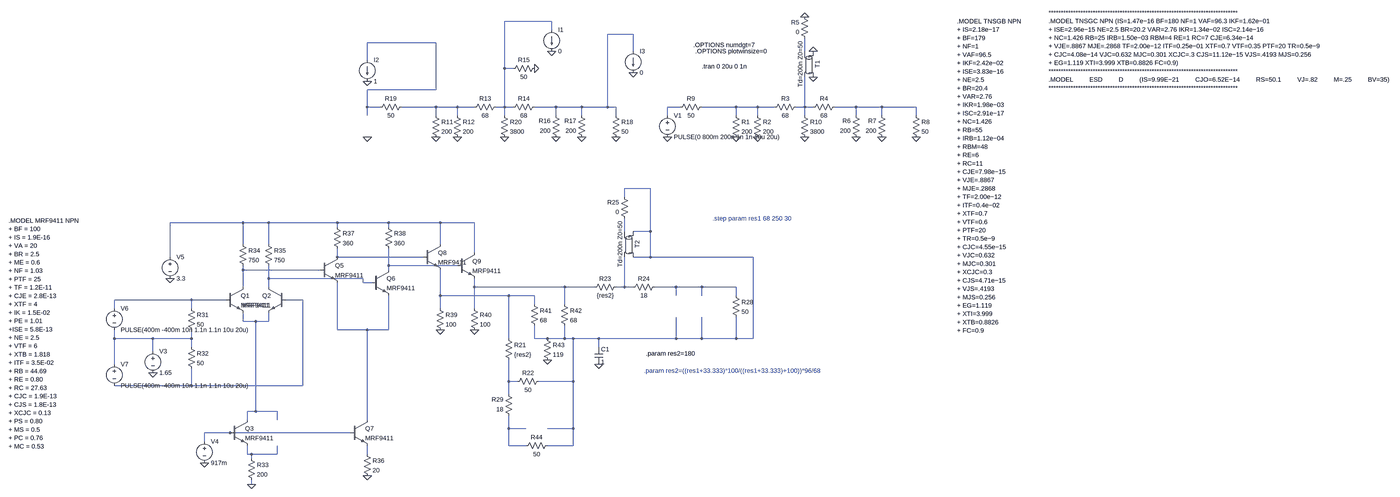
[diagram p0: schematic Draft10.asc, whole sheet]
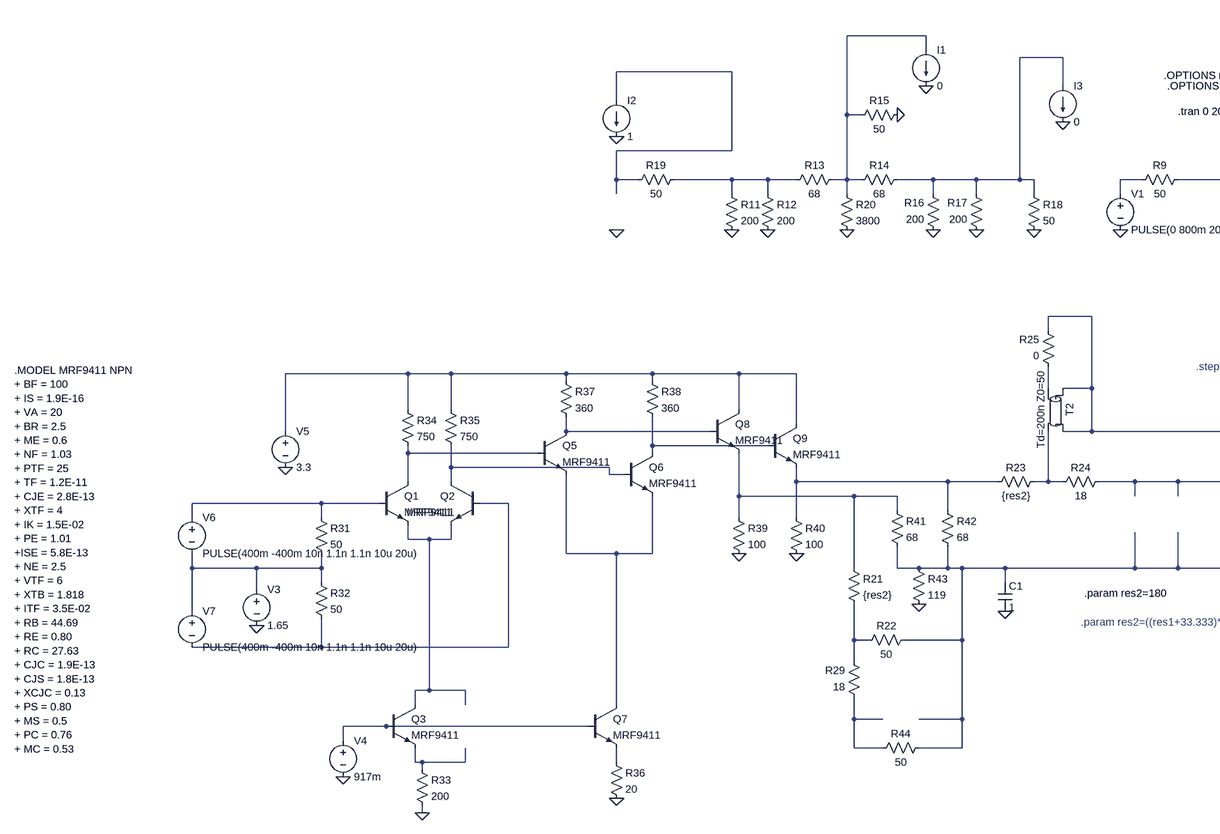
[diagram p1: schematic Draft10.asc, part, row 1 of 1, column 1 of 2]
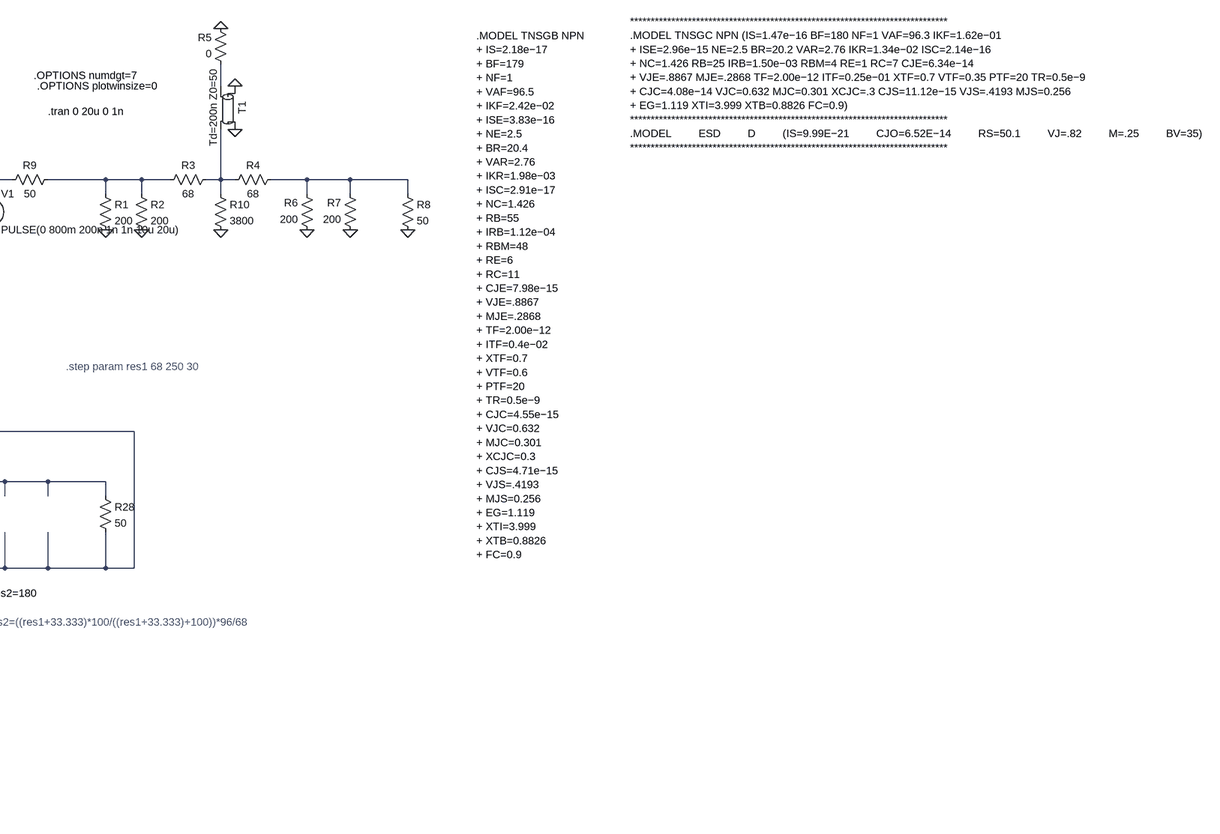
[diagram p2: schematic Draft10.asc, part, row 1 of 1, column 2 of 2]
Draft10.asc, the LTspice schematic file:
Version 4
SHEET 1 2704 1580
WIRE -608 -240 -784 -240
WIRE -608 -208 -608 -240
WIRE -304 -192 -400 -192
WIRE -1040 -160 -1296 -160
WIRE -304 -128 -304 -192
WIRE 336 -128 336 -176
WIRE -1296 -96 -1296 -160
WIRE -784 -64 -784 -240
WIRE -752 -64 -784 -64
WIRE -1040 16 -1040 -160
WIRE -1040 16 -1296 16
WIRE -1296 80 -1296 16
WIRE -1248 80 -1296 80
WIRE -1040 80 -1168 80
WIRE -960 80 -1040 80
WIRE -896 80 -960 80
WIRE -784 80 -784 -64
WIRE -784 80 -816 80
WIRE -752 80 -784 80
WIRE -592 80 -672 80
WIRE -496 80 -592 80
WIRE -400 80 -400 -192
WIRE -400 80 -496 80
WIRE -368 80 -400 80
WIRE -128 80 -176 80
WIRE 80 80 -48 80
WIRE 160 80 80 80
WIRE 224 80 160 80
WIRE 336 80 336 -32
WIRE 336 80 304 80
WIRE 368 80 336 80
WIRE 528 80 448 80
WIRE 624 80 528 80
WIRE 752 80 624 80
WIRE -1296 112 -1296 80
WIRE -1040 112 -1040 80
WIRE -960 112 -960 80
WIRE -784 112 -784 80
WIRE -592 112 -592 80
WIRE -496 112 -496 80
WIRE -368 112 -368 80
WIRE -176 112 -176 80
WIRE 80 112 80 80
WIRE 160 112 160 80
WIRE 336 112 336 80
WIRE 528 112 528 80
WIRE 624 112 624 80
WIRE 752 112 752 80
WIRE -240 384 -336 384
WIRE -336 416 -336 384
WIRE -1760 512 -2032 512
WIRE -1664 512 -1760 512
WIRE -1408 512 -1664 512
WIRE -1216 512 -1408 512
WIRE -1024 512 -1216 512
WIRE -896 512 -1024 512
WIRE -1408 528 -1408 512
WIRE -1216 528 -1216 512
WIRE -336 544 -336 496
WIRE -240 544 -240 384
WIRE -240 544 -304 544
WIRE -1760 592 -1760 512
WIRE -1664 592 -1664 512
WIRE -1024 592 -1024 512
WIRE -896 624 -896 512
WIRE -2032 640 -2032 512
WIRE -1408 640 -1408 608
WIRE -1088 640 -1408 640
WIRE -240 640 -240 544
WIRE -240 640 -304 640
WIRE 144 640 -240 640
WIRE -1216 672 -1216 608
WIRE -960 672 -1216 672
WIRE -1760 688 -1760 672
WIRE -1472 688 -1760 688
WIRE -1216 688 -1216 672
WIRE -1664 720 -1664 672
WIRE -1312 720 -1664 720
WIRE -1312 736 -1312 720
WIRE -1280 736 -1312 736
WIRE -1760 752 -1760 688
WIRE -1664 752 -1664 720
WIRE -896 752 -896 720
WIRE -560 752 -896 752
WIRE -448 752 -560 752
WIRE -336 752 -336 640
WIRE -336 752 -368 752
WIRE -304 752 -336 752
WIRE -144 752 -224 752
WIRE -48 752 -144 752
WIRE 80 752 -48 752
WIRE -1024 784 -1024 688
WIRE -768 784 -1024 784
WIRE -672 784 -768 784
WIRE -144 784 -144 752
WIRE -48 784 -48 752
WIRE 80 784 80 752
WIRE -1952 800 -2240 800
WIRE -1824 800 -1952 800
WIRE -1536 800 -1600 800
WIRE -672 816 -672 784
WIRE -560 816 -560 752
WIRE -2240 832 -2240 800
WIRE -1952 832 -1952 800
WIRE -1024 832 -1024 784
WIRE -896 832 -896 752
WIRE -1760 880 -1760 848
WIRE -1712 880 -1760 880
WIRE -1664 880 -1664 848
WIRE -1664 880 -1712 880
WIRE -1408 912 -1408 736
WIRE -1296 912 -1408 912
WIRE -1216 912 -1216 784
WIRE -1216 912 -1296 912
WIRE -2240 944 -2240 912
WIRE -2096 944 -2240 944
WIRE -1952 944 -1952 912
WIRE -1952 944 -2096 944
WIRE -768 944 -768 784
WIRE -672 944 -672 896
WIRE -624 944 -672 944
WIRE -560 944 -560 896
WIRE -560 944 -624 944
WIRE -528 944 -560 944
WIRE -432 944 -528 944
WIRE -144 944 -144 864
WIRE -144 944 -432 944
WIRE -48 944 -48 864
WIRE -48 944 -144 944
WIRE 80 944 80 864
WIRE 80 944 -48 944
WIRE 144 944 144 640
WIRE 144 944 80 944
WIRE -1952 976 -1952 944
WIRE -432 976 -432 944
WIRE -2096 992 -2096 944
WIRE -2240 1040 -2240 944
WIRE -768 1104 -768 1024
WIRE -736 1104 -768 1104
WIRE -528 1104 -528 944
WIRE -528 1104 -656 1104
WIRE -1952 1120 -1952 1056
WIRE -1952 1120 -2240 1120
WIRE -1536 1120 -1536 800
WIRE -1536 1120 -1952 1120
WIRE -768 1152 -768 1104
WIRE -1712 1216 -1712 880
WIRE -1712 1216 -1744 1216
WIRE -1632 1216 -1712 1216
WIRE -1744 1248 -1744 1216
WIRE -1632 1248 -1632 1216
WIRE -1296 1248 -1296 912
WIRE -768 1280 -768 1232
WIRE -704 1280 -768 1280
WIRE -528 1280 -528 1104
WIRE -528 1280 -624 1280
WIRE -1808 1296 -1904 1296
WIRE -1360 1296 -1808 1296
WIRE -1904 1328 -1904 1296
WIRE -768 1344 -768 1280
WIRE -704 1344 -768 1344
WIRE -528 1344 -528 1280
WIRE -528 1344 -624 1344
WIRE -1744 1376 -1744 1344
WIRE -1728 1376 -1744 1376
WIRE -1632 1376 -1632 1344
WIRE -1632 1376 -1728 1376
WIRE -1296 1376 -1296 1344
WIRE -1728 1392 -1728 1376
WIRE -1728 1488 -1728 1472
FLAG 752 192 0
FLAG 624 192 0
FLAG 528 192 0
FLAG 160 192 0
FLAG 80 192 0
FLAG 336 -256 0
FLAG 368 -32 0
FLAG -176 192 0
FLAG 368 -128 0
FLAG 336 192 0
FLAG -368 192 0
FLAG -496 192 0
FLAG -592 192 0
FLAG -960 192 0
FLAG -1040 192 0
FLAG -1296 192 0
FLAG -784 192 0
FLAG -608 -128 0
FLAG -1296 -16 0
FLAG -304 -48 0
FLAG -672 -64 0
FLAG -2096 1072 0
FLAG -1904 1408 0
FLAG -1728 1488 0
FLAG -2032 720 0
FLAG -1296 1456 0
FLAG -896 912 0
FLAG -1024 912 0
FLAG -624 1024 0
FLAG -432 1040 0
SYMBOL res 64 96 R0
SYMATTR InstName R1
SYMATTR Value 200
SYMBOL res 144 96 R0
SYMATTR InstName R2
SYMATTR Value 200
SYMBOL res 320 64 R90
WINDOW 0 0 56 VBottom 2
WINDOW 3 32 56 VTop 2
SYMATTR InstName R3
SYMATTR Value 68
SYMBOL res 464 64 R90
WINDOW 0 0 56 VBottom 2
WINDOW 3 32 56 VTop 2
SYMATTR InstName R4
SYMATTR Value 68
SYMBOL res 352 -160 R180
WINDOW 0 36 76 Left 2
WINDOW 3 36 40 Left 2
SYMATTR InstName R5
SYMATTR Value 0
SYMBOL res 544 208 R180
WINDOW 0 36 76 Left 2
WINDOW 3 36 40 Left 2
SYMATTR InstName R6
SYMATTR Value 200
SYMBOL res 640 208 R180
WINDOW 0 36 76 Left 2
WINDOW 3 36 40 Left 2
SYMATTR InstName R7
SYMATTR Value 200
SYMBOL res 736 96 R0
SYMATTR InstName R8
SYMATTR Value 50
SYMBOL res -32 64 R90
WINDOW 0 0 56 VBottom 2
WINDOW 3 32 56 VTop 2
SYMATTR InstName R9
SYMATTR Value 50
SYMBOL tline 352 -80 R90
SYMATTR InstName T1
SYMATTR Value Td=200n Z0=50
SYMBOL voltage -176 96 R0
WINDOW 123 0 0 Left 0
WINDOW 39 0 0 Left 0
SYMATTR InstName V1
SYMATTR Value PULSE(0 800m 200n 1n 1n 10u 20u)
SYMBOL res 320 96 R0
SYMATTR InstName R10
SYMATTR Value 3800
SYMBOL res -1056 96 R0
SYMATTR InstName R11
SYMATTR Value 200
SYMBOL res -976 96 R0
SYMATTR InstName R12
SYMATTR Value 200
SYMBOL res -800 64 R90
WINDOW 0 0 56 VBottom 2
WINDOW 3 32 56 VTop 2
SYMATTR InstName R13
SYMATTR Value 68
SYMBOL res -656 64 R90
WINDOW 0 0 56 VBottom 2
WINDOW 3 32 56 VTop 2
SYMATTR InstName R14
SYMATTR Value 68
SYMBOL res -576 208 R180
WINDOW 0 36 76 Left 2
WINDOW 3 36 40 Left 2
SYMATTR InstName R16
SYMATTR Value 200
SYMBOL res -480 208 R180
WINDOW 0 36 76 Left 2
WINDOW 3 36 40 Left 2
SYMATTR InstName R17
SYMATTR Value 200
SYMBOL res -384 96 R0
SYMATTR InstName R18
SYMATTR Value 50
SYMBOL res -1152 64 R90
WINDOW 0 0 56 VBottom 2
WINDOW 3 32 56 VTop 2
SYMATTR InstName R19
SYMATTR Value 50
SYMBOL res -800 96 R0
SYMATTR InstName R20
SYMATTR Value 3800
SYMBOL current -608 -208 R0
WINDOW 123 0 0 Left 0
WINDOW 39 0 0 Left 0
SYMATTR InstName I1
SYMATTR Value 0
SYMBOL current -1296 -96 R0
WINDOW 123 0 0 Left 0
WINDOW 39 0 0 Left 0
SYMATTR InstName I2
SYMATTR Value 1
SYMBOL current -304 -128 R0
WINDOW 123 0 0 Left 0
WINDOW 39 0 0 Left 0
SYMATTR InstName I3
SYMATTR Value 0
SYMBOL res -656 -80 R90
WINDOW 0 0 56 VBottom 2
WINDOW 3 32 56 VTop 2
SYMATTR InstName R15
SYMATTR Value 50
SYMBOL res -352 736 R90
WINDOW 0 0 56 VBottom 2
WINDOW 3 32 56 VTop 2
SYMATTR InstName R23
SYMATTR Value {res2}
SYMBOL res -208 736 R90
WINDOW 0 0 56 VBottom 2
WINDOW 3 32 56 VTop 2
SYMATTR InstName R24
SYMATTR Value 18
SYMBOL res -320 512 R180
WINDOW 0 36 76 Left 2
WINDOW 3 36 40 Left 2
SYMATTR InstName R25
SYMATTR Value 0
SYMBOL res 64 768 R0
SYMATTR InstName R28
SYMATTR Value 50
SYMBOL tline -320 592 R90
SYMATTR InstName T2
SYMATTR Value Td=200n Z0=50
SYMBOL res -1968 816 R0
SYMATTR InstName R31
SYMATTR Value 50
SYMBOL res -1968 960 R0
SYMATTR InstName R32
SYMATTR Value 50
SYMBOL voltage -2096 976 R0
WINDOW 123 0 0 Left 0
WINDOW 39 0 0 Left 0
SYMATTR InstName V3
SYMATTR Value 1.65
SYMBOL npn -1824 752 R0
SYMATTR InstName Q1
SYMATTR Value MRF9411
SYMBOL npn -1600 752 M0
SYMATTR InstName Q2
SYMATTR Value MRF9411
SYMBOL npn -1808 1248 R0
SYMATTR InstName Q3
SYMATTR Value MRF9411
SYMBOL voltage -1904 1312 R0
WINDOW 123 0 0 Left 0
WINDOW 39 0 0 Left 0
SYMATTR InstName V4
SYMATTR Value 917m
SYMBOL res -1744 1376 R0
SYMATTR InstName R33
SYMATTR Value 200
SYMBOL res -1776 576 R0
SYMATTR InstName R34
SYMATTR Value 750
SYMBOL res -1680 576 R0
SYMATTR InstName R35
SYMATTR Value 750
SYMBOL voltage -2032 624 R0
WINDOW 123 0 0 Left 0
WINDOW 39 0 0 Left 0
SYMATTR InstName V5
SYMATTR Value 3.3
SYMBOL voltage -2240 816 R0
WINDOW 123 0 0 Left 0
WINDOW 39 0 0 Left 0
SYMATTR InstName V6
SYMATTR Value PULSE(400m -400m 10n 1.1n 1.1n 10u 20u)
SYMBOL voltage -2240 1024 R0
WINDOW 123 0 0 Left 0
WINDOW 39 0 0 Left 0
SYMATTR InstName V7
SYMATTR Value PULSE(400m -400m 10n 1.1n 1.1n 10u 20u)
SYMBOL npn -1472 640 R0
SYMATTR InstName Q5
SYMATTR Value MRF9411
SYMBOL npn -1280 688 R0
SYMATTR InstName Q6
SYMATTR Value MRF9411
SYMBOL npn -1360 1248 R0
SYMATTR InstName Q7
SYMATTR Value MRF9411
SYMBOL res -1312 1360 R0
SYMATTR InstName R36
SYMATTR Value 20
SYMBOL res -1424 512 R0
SYMATTR InstName R37
SYMATTR Value 360
SYMBOL res -1232 512 R0
SYMATTR InstName R38
SYMATTR Value 360
SYMBOL npn -1088 592 R0
SYMATTR InstName Q8
SYMATTR Value MRF9411
SYMBOL npn -960 624 R0
SYMATTR InstName Q9
SYMATTR Value MRF9411
SYMBOL res -1040 816 R0
SYMATTR InstName R39
SYMATTR Value 100
SYMBOL res -912 816 R0
SYMATTR InstName R40
SYMATTR Value 100
SYMBOL res -688 800 R0
SYMATTR InstName R41
SYMATTR Value 68
SYMBOL res -576 800 R0
SYMATTR InstName R42
SYMATTR Value 68
SYMBOL res -640 928 R0
SYMATTR InstName R43
SYMATTR Value 119
SYMBOL res -784 928 R0
SYMATTR InstName R21
SYMATTR Value {res2}
SYMBOL res -640 1088 R90
WINDOW 0 0 56 VBottom 2
WINDOW 3 32 56 VTop 2
SYMATTR InstName R22
SYMATTR Value 50
SYMBOL res -752 1248 R180
WINDOW 0 36 76 Left 2
WINDOW 3 36 40 Left 2
SYMATTR InstName R29
SYMATTR Value 18
SYMBOL res -608 1328 R90
WINDOW 0 0 56 VBottom 2
WINDOW 3 32 56 VTop 2
SYMATTR InstName R44
SYMATTR Value 50
SYMBOL cap -448 976 R0
SYMATTR InstName C1
SYMATTR Value 1
TEXT -48 -72 Left 2 !.tran 0 20u 0 1n
TEXT 936 -240 Left 2 !.MODEL TNSGB NPN\n+ IS=2.18e−17\n+ BF=179\n+ NF=1 \n+ VAF=96.5 \n+ IKF=2.42e−02\n+ ISE=3.83e−16\n+ NE=2.5\n+ BR=20.4\n+ VAR=2.76\n+ IKR=1.98e−03\n+ ISC=2.91e−17\n+ NC=1.426\n+ RB=55\n+ IRB=1.12e−04\n+ RBM=48\n+ RE=6\n+ RC=11\n+ CJE=7.98e−15\n+ VJE=.8867\n+ MJE=.2868\n+ TF=2.00e−12\n+ ITF=0.4e−02\n+ XTF=0.7\n+ VTF=0.6\n+ PTF=20\n+ TR=0.5e−9\n+ CJC=4.55e−15\n+ VJC=0.632\n+ MJC=0.301\n+ XCJC=0.3\n+ CJS=4.71e−15\n+ VJS=.4193\n+ MJS=0.256\n+ EG=1.119\n+ XTI=3.999\n+ XTB=0.8826\n+ FC=0.9
TEXT 1368 -272 Left 2 !*****************************************************************************\n.MODEL TNSGC NPN (IS=1.47e−16 BF=180 NF=1 VAF=96.3 IKF=1.62e−01\n+ ISE=2.96e−15 NE=2.5 BR=20.2 VAR=2.76 IKR=1.34e−02 ISC=2.14e−16\n+ NC=1.426 RB=25 IRB=1.50e−03 RBM=4 RE=1 RC=7 CJE=6.34e−14\n+ VJE=.8867 MJE=.2868 TF=2.00e−12 ITF=0.25e−01 XTF=0.7 VTF=0.35 PTF=20 TR=0.5e−9\n+ CJC=4.08e−14 VJC=0.632 MJC=0.301 XCJC=.3 CJS=11.12e−15 VJS=.4193 MJS=0.256\n+ EG=1.119 XTI=3.999 XTB=0.8826 FC=0.9)\n*****************************************************************************\n.MODEL         ESD         D         (IS=9.99E−21         CJO=6.52E−14         RS=50.1         VJ=.82         M=.25         BV=35)\n*****************************************************************************
TEXT -2648 504 Left 2 !.MODEL MRF9411 NPN \n+ BF = 100\n+ IS = 1.9E-16\n+ VA = 20\n+ BR = 2.5\n+ ME = 0.6\n+ NF = 1.03\n+ PTF = 25\n+ TF = 1.2E-11\n+ CJE = 2.8E-13\n+ XTF = 4\n+ IK = 1.5E-02\n+ PE = 1.01\n+ISE = 5.8E-13\n+ NE = 2.5\n+ VTF = 6\n+ XTB = 1.818\n+ ITF = 3.5E-02\n+ RB = 44.69\n+ RE = 0.80\n+ RC = 27.63\n+ CJC = 1.9E-13\n+ CJS = 1.8E-13\n+ XCJC = 0.13\n+ PS = 0.80\n+ MS = 0.5\n+ PC = 0.76\n+ MC = 0.53
TEXT -8 496 Left 2 ;.step param res1 68 250 30
TEXT -264 1064 Left 2 ;.param res2=((res1+33.333)*100/((res1+33.333)+100))*96/68
TEXT -256 1000 Left 2 !.param res2=180
TEXT -72 -128 Left 2 !.OPTIONS plotwinsize=0
TEXT -80 -152 Left 2 !.OPTIONS numdgt=7

The netlist it stands for:
* Draft10.asc
R1 N007 0 200
R2 N007 0 200
R3 N008 N007 68
R4 N009 N008 68
R5 N004 0 0
R6 0 N009 200
R7 0 N009 200
R8 N009 0 50
R9 N007 N006 50
T1 0 N004 0 N008 Td=200n Z0=50
V1 N006 0 PULSE(0 800m 200n 1n 1n 10u 20u)
R10 N008 0 3800
R11 N005 0 200
R12 N005 0 200
R13 N001 N005 68
R14 N002 N001 68
R16 0 N002 200
R17 0 N002 200
R18 N002 0 50
R19 N005 N003 50
R20 N001 0 3800
I1 N001 0 0
I2 N003 0 1
I3 N002 0 0
R15 0 N001 50
R23 N018 N017 {res2}
R24 N019 N018 18
R25 N012 N010 0
R28 N019 N010 50
T2 N010 N012 N010 N018 Td=200n Z0=50
R31 N021 N025 50
R32 N025 N022 50
V3 N025 0 1.65
Q1 N015 N021 N023 0 MRF9411
Q2 N016 N022 N023 0 MRF9411
Q3 N023 N028 N029 0 MRF9411
V4 N028 0 917m
R33 N029 0 200
R34 N011 N015 750
R35 N011 N016 750
V5 N011 0 3.3
V6 N021 N025 PULSE(400m -400m 10n 1.1n 1.1n 10u 20u)
V7 N025 N022 PULSE(400m -400m 10n 1.1n 1.1n 10u 20u)
Q5 N013 N015 N024 0 MRF9411
Q6 N014 N016 N024 0 MRF9411
Q7 N024 N028 N030 0 MRF9411
R36 N030 0 20
R37 N011 N013 360
R38 N011 N014 360
Q8 N011 N013 N020 0 MRF9411
Q9 N011 N014 N017 0 MRF9411
R39 N020 0 100
R40 N017 0 100
R41 N020 N010 68
R42 N017 N010 68
R43 N010 0 119
R21 N020 N026 {res2}
R22 N010 N026 50
R29 N027 N026 18
R44 N010 N027 50
C1 N010 0 1
.model NPN NPN
.model PNP PNP
.lib standard.bjt
.tran 0 20u 0 1n
.MODEL TNSGB NPN
+ IS=2.18e−17
+ BF=179
+ NF=1
+ VAF=96.5
+ IKF=2.42e−02
+ ISE=3.83e−16
+ NE=2.5
+ BR=20.4
+ VAR=2.76
+ IKR=1.98e−03
+ ISC=2.91e−17
+ NC=1.426
+ RB=55
+ IRB=1.12e−04
+ RBM=48
+ RE=6
+ RC=11
+ CJE=7.98e−15
+ VJE=.8867
+ MJE=.2868
+ TF=2.00e−12
+ ITF=0.4e−02
+ XTF=0.7
+ VTF=0.6
+ PTF=20
+ TR=0.5e−9
+ CJC=4.55e−15
+ VJC=0.632
+ MJC=0.301
+ XCJC=0.3
+ CJS=4.71e−15
+ VJS=.4193
+ MJS=0.256
+ EG=1.119
+ XTI=3.999
+ XTB=0.8826
+ FC=0.9
*****************************************************************************
.MODEL TNSGC NPN (IS=1.47e−16 BF=180 NF=1 VAF=96.3 IKF=1.62e−01
+ ISE=2.96e−15 NE=2.5 BR=20.2 VAR=2.76 IKR=1.34e−02 ISC=2.14e−16
+ NC=1.426 RB=25 IRB=1.50e−03 RBM=4 RE=1 RC=7 CJE=6.34e−14
+ VJE=.8867 MJE=.2868 TF=2.00e−12 ITF=0.25e−01 XTF=0.7 VTF=0.35 PTF=20 TR=0.5e−9
+ CJC=4.08e−14 VJC=0.632 MJC=0.301 XCJC=.3 CJS=11.12e−15 VJS=.4193 MJS=0.256
+ EG=1.119 XTI=3.999 XTB=0.8826 FC=0.9)
*****************************************************************************
.MODEL         ESD         D         (IS=9.99E−21         CJO=6.52E−14         RS=50.1         VJ=.82         M=.25         BV=35)
*****************************************************************************
.MODEL MRF9411 NPN
+ BF = 100
+ IS = 1.9E-16
+ VA = 20
+ BR = 2.5
+ ME = 0.6
+ NF = 1.03
+ PTF = 25
+ TF = 1.2E-11
+ CJE = 2.8E-13
+ XTF = 4
+ IK = 1.5E-02
+ PE = 1.01
+ISE = 5.8E-13
+ NE = 2.5
+ VTF = 6
+ XTB = 1.818
+ ITF = 3.5E-02
+ RB = 44.69
+ RE = 0.80
+ RC = 27.63
+ CJC = 1.9E-13
+ CJS = 1.8E-13
+ XCJC = 0.13
+ PS = 0.80
+ MS = 0.5
+ PC = 0.76
+ MC = 0.53
* .step param res1 68 250 30
* .param res2=((res1+33.333)*100/((res1+33.333)+100))*96/68
.param res2=180
.OPTIONS plotwinsize=0
.OPTIONS numdgt=7
.backanno
.end